# Altium schematic sheet unity_amplifier.SchDoc
size A4; SheetNumber: 2; SheetTotal: 5
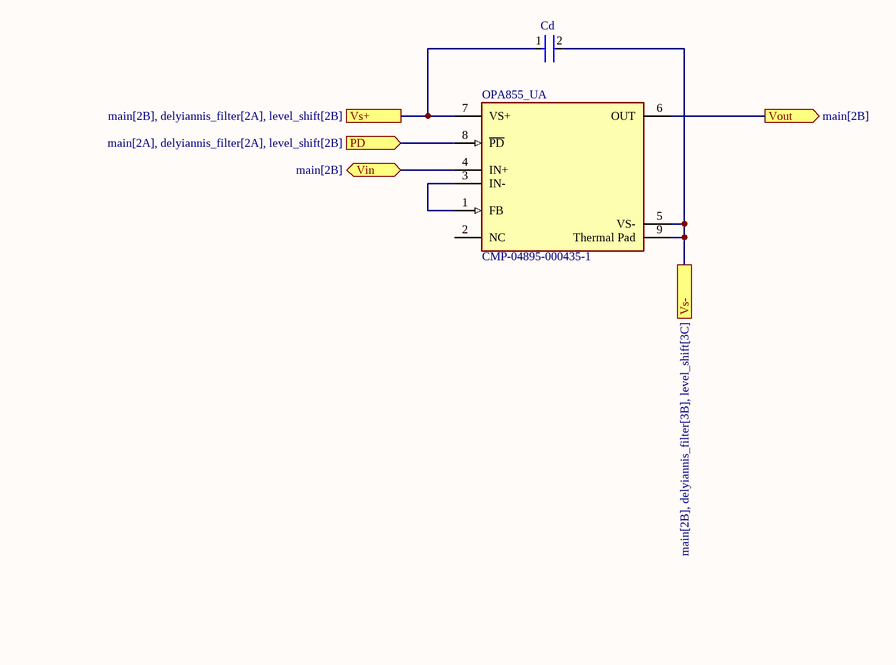
[diagram p0: unity_amplifier.SchDoc]

## Parts
Cd  C0402C104K4RACTU  [FP-C0402-BB-MFG]  (value not drawn)
OPA855_UA  CMP-04895-000435-1  [FP-DSG0008A-MFG]

## Ports
PD (in, see main[2A], delyiannis_filter[2A], level_shift[2B]), Vin (bidir, see main[2B]), Vout (out, see main[2B]), Vs+ (see main[2B], delyiannis_filter[2A], level_shift[2B]), Vs- (see main[2B], delyiannis_filter[3B], level_shift[3C])

## Nets
PD: OPA855_UA.8(~{PD}) ; port PD
Vin: OPA855_UA.4(IN+) ; port Vin
Vout: OPA855_UA.6(OUT) ; port Vout
Vs+: Cd.1 OPA855_UA.7(VS+) ; port Vs+
Vs-: Cd.2 OPA855_UA.5(VS-) OPA855_UA.9(Thermal_Pad) ; port Vs-
NetOPA855_UA_1: OPA855_UA.1(FB) OPA855_UA.3(IN-)

Not connected (* = marked no-connect by the designer): OPA855_UA 2(NC)

## Library data of the parts
Cd = CMP-2008-02108-2: CAP CER 0.1UF 16V X7R 0402; Manufacturer: Kemet; Value: 0.10 μF; Tolerance: 0.1; Temperature Coefficient: 15%; Voltage Rating: 16 V; Package: C0402-BB; Automotive: No; Ipc Land Pattern Name: CAPC10050X50; Device Class L3: Ceramic Capacitors; Capacitance: 0.10 μF; Octopart: https://octopart.com/c0402c104k4ractu-kemet-94158; Temperature Characteristic: X7R; Mouser Description: Cap Ceramic 0.1uF 16V X7R 10% SMD 0402 125?C Paper T/R - Tape and Reel (Alt: C0402C104K4RAC TU); ComponentLink2Description: Datasheet; Temperature Range Low: -55°C; RoHS: TRUE; Device Class L1: Passive Components; Manufacturer Part Number: C0402C104K4RACTU; Material: Ceramic; Temperature Range High: +125°C; Device Class L2: Capacitors; ComponentLink2URL: https://content.kemet.com/datasheets/KEM_C1002_X7R_SMD.pdf; Category: Cap; Height: 0.55mm; Temperature: -55°C to +125°C; Lead Free: Yes; Digikey Description: CAP CER 0.1UF 16V X7R 0402
OPA855_UA = CMP-007-000000-2: IC OPAMP GP 1 CIRCUIT 8WSON; Source: Components - 05.10.22 - 21.23.SchLib; RoHS Compliant: Yes; Design Item ID: CMP-04895-000435-1